# EAGLE design pc_afe4490_brk_v2 (EAGLE 6.4)
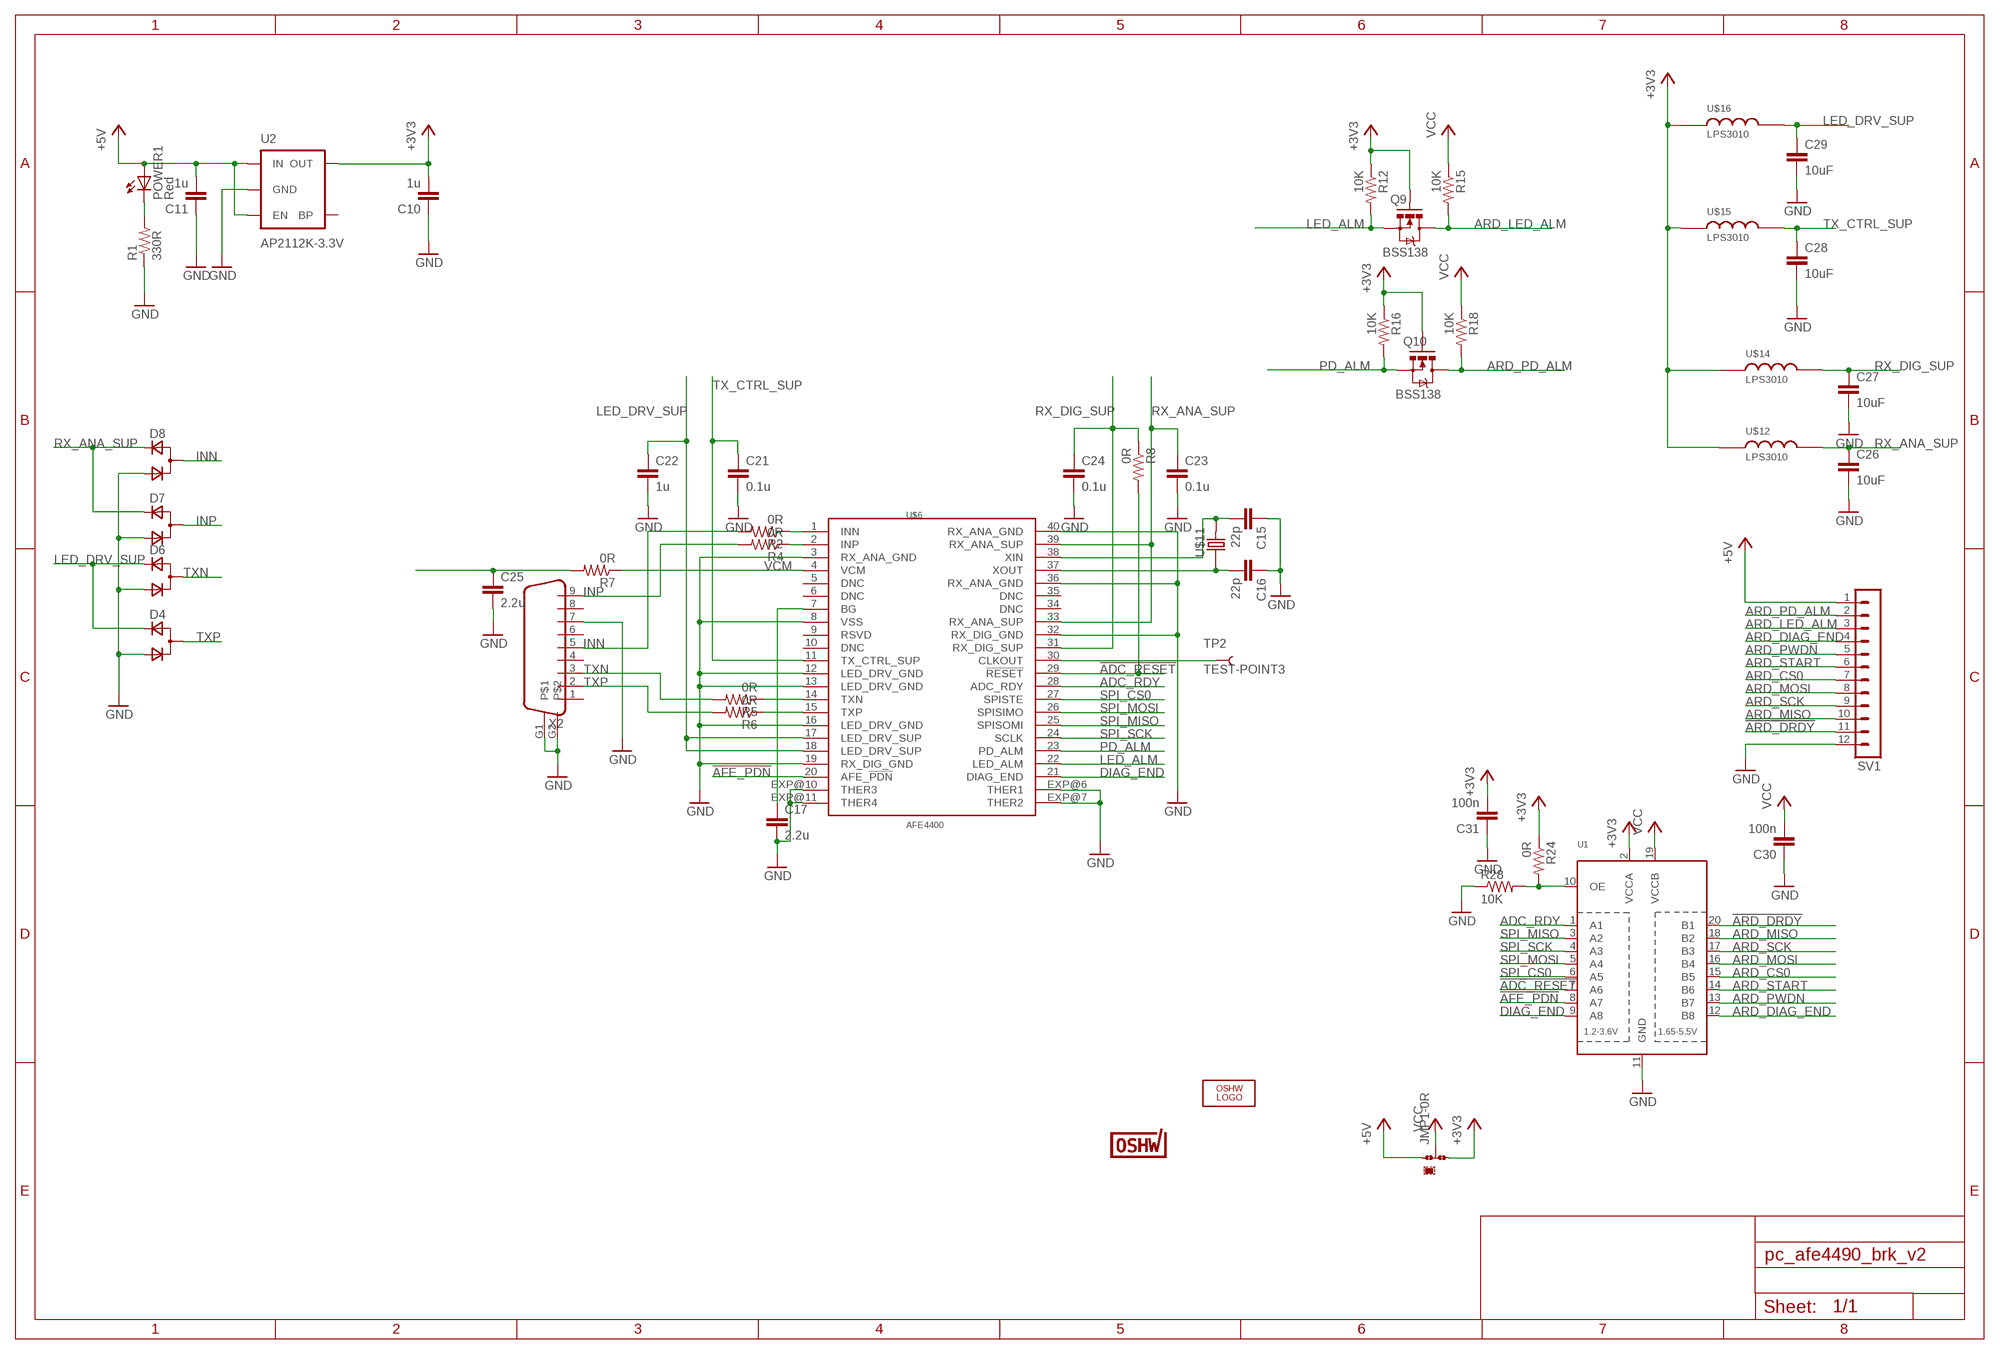
[diagram p0: schematic, sheet 1]

## Parts
C10  1u  C-EUC0805  [C0805]
C11  1u  C-EUC0805  [C0805]
C15  22p  C-EUC0402  [C0402]
C16  22p  C-EUC0402  [C0402]
C17  2.2u  C-EUC0402  [C0402]
C21  0.1u  C-EUC0805  [C0805]
C22  1u  C-EUC0805  [C0805]
C23  0.1u  C-EUC0805  [C0805]
C24  0.1u  C-EUC0805  [C0805]
C25  2.2u  C-EUC0402  [C0402]
C26  10uF  C-EUC0805  [C0805]
C27  10uF  C-EUC0805  [C0805]
C28  10uF  C-EUC0805  [C0805]
C29  10uF  C-EUC0805  [C0805]
C30  100n  C-EUC0402  [C0402]
C31  100n  C-EUC0402  [C0402]
D4  D_ACACSOT323  [SOT323]
D6  D_ACACSOT323  [SOT323]
D7  D_ACACSOT323  [SOT323]
D8  D_ACACSOT323  [SOT323]
JMP1  0R-JUMPA  [A0R-JMP]
LOGO2  OSHW_LOGO_FILLX0200-NT  [OSHW_FILLX200_NOTEXT]
POWER1  Red  LEDCHIPLED_0603  [CHIPLED_0603]
Q9  BSS138  MOSFET-NCHANNELSMD  [SOT23-3]
Q10  BSS138  MOSFET-NCHANNELSMD  [SOT23-3]
R1  330R  R-US_R0805  [R0805]
R2  0R  R-US_R0402  [R0402]
R4  0R  R-US_R0402  [R0402]
R5  0R  R-US_R0805  [R0805]
R6  0R  R-US_R0805  [R0805]
R7  0R  R-US_R0402  [R0402]
R8  0R  R-US_R0805  [R0805]
R12  10K  RESISTOR0805-RES  [0805]
R15  10K  RESISTOR0805-RES  [0805]
R16  10K  RESISTOR0805-RES  [0805]
R18  10K  RESISTOR0805-RES  [0805]
R24  0R  RESISTOR0805-RES  [0805]
R28  10K  RESISTOR0805-RES  [0805]
SV1  MA12-1  [MA12-1]
TP2  TEST-POINT3  [PAD.03X.03]
U1  TXB0108PWR  [TSSOP20]
U2  AP2112K-3.3V  V_REG_LDOSMD  [SOT23-5]
U$1  PROTY-LOGO  [LOGO-PROTY]
U$3  PROTY_LOGO_WITH_TEXT  [PROTY_WITH_TEXT]
U$4  CERT-SMALL  [CERT-SMALL-SILK]
U$6  AFE4400  [QFN-40]
U$11  ABM3  [ABM3]
U$12  LPS3010  LPS  [LPS]
U$14  LPS3010  LPS  [LPS]
U$15  LPS3010  LPS  [LPS]
U$16  LPS3010  LPS  [LPS]
X2  DB9  [DB9]

## Nets
!ADC_RESET: R8.2 U1.7(A6) U$6.29(!RESET)
!AFE_PDN: U1.8(A7) U$6.20(AFE_!PDN)
!ARD_DRDY: SV1.11 U1.20(B1)
+3V3: C10.2 C31.2 JMP1.3 Q9.1(G) Q10.1(G) R12.1 R16.1 R24.1 U1.2(VCCA) U2.5(OUT) U$12.1 U$14.1 U$15.1 U$16.1
+5V: C11.2 JMP1.1 POWER1.A SV1.1 U2.1(IN) U2.3(EN)
ADC_RDY: U1.1(A1) U$6.28(ADC_RDY)
ARD_CS0: SV1.7 U1.15(B5)
ARD_DIAG_END: SV1.4 U1.12(B8)
ARD_LED_ALM: Q9.3(D) R15.2 SV1.3
ARD_MISO: SV1.10 U1.18(B2)
ARD_MOSI: SV1.8 U1.16(B4)
ARD_PD_ALM: Q10.3(D) R18.2 SV1.2
ARD_PWDN: SV1.5 U1.13(B7)
ARD_SCK: SV1.9 U1.17(B3)
ARD_START: SV1.6 U1.14(B6)
DIAG_END: U1.9(A8) U$6.21(DIAG_END)
GND: C10.1 C11.1 C15.1 C16.1 C17.2 C21.2 C22.2 C23.2 C24.2 C25.2 C26.2 C27.2 C28.2 C29.2 C30.1 C31.1 D4.2(C) D6.2(C) D7.2(C) D8.2(C) R1.1 R28.1 SV1.12 U1.11(GND) U2.2(GND) U$6.3(RX_ANA_GND) U$6.8(VSS) U$6.12(LED_DRV_GND) U$6.13(LED_DRV_GND) U$6.16(LED_DRV_GND) U$6.19(RX_DIG_GND) U$6.32(RX_DIG_GND) U$6.36(RX_ANA_GND) U$6.40(RX_ANA_GND) U$6.EXP@6(THER1) U$6.EXP@7(THER2) U$6.EXP@10(THER3) U$6.EXP@11(THER4) X2.7 X2.G1 X2.G2
INN: D8.1(CA) R2.2 X2.5
INP: D7.1(CA) R4.2 X2.9
LED_ALM: Q9.2(S) R12.2 U$6.22(LED_ALM)
LED_DRV_SUP: C22.1 C29.1 D4.3(A) D6.3(A) U$6.17(LED_DRV_SUP) U$6.18(LED_DRV_SUP) U$16.2
N$15: POWER1.C R1.2
N$16: C15.2 U$6.38(XIN) U$11.2
N$19: C16.2 U$6.37(XOUT) U$11.1
N$20: C17.1 U$6.7(BG)
N$22: TP2.P$1 U$6.30(CLKOUT)
N$23: R2.1 U$6.1(INN)
N$24: R4.1 U$6.2(INP)
N$25: R5.1 U$6.14(TXN)
N$26: R6.1 U$6.15(TXP)
N$27: C25.1 R7.2
OE: R24.2 R28.2 U1.10(OE)
PD_ALM: Q10.2(S) R16.2 U$6.23(PD_ALM)
RX_ANA_SUP: C23.1 C26.1 D7.3(A) D8.3(A) U$6.33(RX_ANA_SUP) U$6.39(RX_ANA_SUP) U$12.2
RX_DIG_SUP: C24.1 C27.1 R8.1 U$6.31(RX_DIG_SUP) U$14.2
SPI_CS0: U1.6(A5) U$6.27(SPISTE)
SPI_MISO: U1.3(A2) U$6.25(SPISOMI)
SPI_MOSI: U1.5(A4) U$6.26(SPISIMO)
SPI_SCK: U1.4(A3) U$6.24(SCLK)
TX_CTRL_SUP: C21.1 C28.1 U$6.11(TX_CTRL_SUP) U$15.2
TXN: D6.1(CA) R5.2 X2.3
TXP: D4.1(CA) R6.2 X2.2
VCC: C30.2 JMP1.2 R15.1 R18.1 U1.19(VCCB)
VCM: R7.1 U$6.4(VCM)
Unconnected: U2.4(BP) U$6.5(DNC) U$6.6(DNC) U$6.9(RSVD) U$6.10(DNC) U$6.34(DNC) U$6.35(DNC) X2.1 X2.4 X2.6 X2.8

## Library data of the parts
C10 C11 C15-C17 C21-C31 = rcl:C-EU: CAPACITOR, European symbol
D4 D6-D8 = zetex:D_ACAC: Dual DIODE; OC_FARNELL: unknown; OC_NEWARK: unknown
JMP1 = jump-0r-smd:0R-JUMP: SMD 0R 0805 Jumper
LOGO2 = ohw-logo:OSHW_LOGO_FILL
POWER1 = led:LED: LED OSRAM: - CHIPLED LG R971, LG N971, LY N971, LG Q971, LY Q971, LO R971, LY R971 LH N974, LH R974 LS Q976, LO Q976, LY Q976 LO Q996 - Hyper CHIPLED LW Q18S LB Q993, LB Q99A, LB R99A - SideLED LS A670, LO A670, LY A670, LG A670, LP A670 LB A673, LV A673, LT A673, LW A673 LH A674 LY A675 LS A676, LA A676, LO A676, LY A676, LW A676 LS A679, LY A679, LG A679 - Hyper Micro SIDELED® LS Y876, LA Y876, LO Y876, LY Y876 LT Y87S - SmartLED LW L88C, LW L88S LB L89C, LB L89S, LG L890 LS L89K, LO L89K, LY L89K LS L896, LA L896, LO L896, LY L896 - TOPLED LS T670, LO T670, LY T670, LG T670, LP T670 LSG T670, LSP T670, LSY T670, LOP T670, LYG T670 LG T671, LOG T671, LSG T671 LB T673, LV T673, LT T673, LW T673 LH T674 LS T676, LA T676, LO T676, LY T676, LB T676, LH T676, LSB T676, LW T676 LB T67C, LV T67C, LT T67C, LS T67K, LO T67K, LY T67K, LW E67C LS E67B, LA E67B, LO E67B, LY E67B, LB E67C, LV E67C, LT E67C LW T67C LS T679, LY T679, LG T679 LS T770, LO T770, LY T770, LG T770, LP T770 LB T773, LV T773, LT T773, LW T773 LH T774 LS E675, LA E675, LY E675, LS T675 LS T776, LA T776, LO T776, LY T776, LB T776 LHGB T686 LT T68C, LB T68C - Hyper Mini TOPLED® LB M676 - Mini TOPLED Santana® LG M470 LS M47K, LO M47K, LY M47K Source: http://www.osram.convergy.de LUXEON: - LUMILED® LXK2-PW12-R00, LXK2-PW12-S00, LXK2-PW14-U00, LXK2-PW14-V00 LXK2-PM12-R00, LXK2-PM12-S00, LXK2-PM14-U00 LXK2-PE12-Q00, LXK2-PE12-R00, LXK2-PE12-S00, LXK2-PE14-T00, LXK2-PE14-U00 LXK2-PB12-K00, LXK2-PB12-L00, LXK2-PB12-M00, LXK2-PB14-N00, LXK2-PB14-P00, LXK2-PB14-Q00 LXK2-PR12-L00, LXK2-PR12-M00, LXK2-PR14-Q00, LXK2-PR14-R00 LXK2-PD12-Q00, LXK2-PD12-R00, LXK2-PD12-S00 LXK2-PH12-R00, LXK2-PH12-S00 LXK2-PL12-P00, LXK2-PL12-Q00, LXK2-PL12-R00 Source: www.luxeon.com KINGBRIGHT: KA-3528ASYC Source: www.kingbright.com
Q9 Q10 = SparkFun:MOSFET-NCHANNEL
R1 R2 R4-R8 = rcl:R-US_: RESISTOR, American symbol
R12 R15 R16 R18 R24 R28 = SparkFun:RESISTOR: Resistor Basic schematic elements and footprints for 0603, 1206, and PTH resistors.
SV1 = con-lstb:MA12-1: PIN HEADER; OC_FARNELL: unknown; OC_NEWARK: unknown
TP2 = SparkFun:TEST-POINT
U1 = adafruit:TXB0108PWR: 8-Bit Bi-Directional Level Shifter 1.2V-3.6V (VCCA) to 1.65V-5.5V (VCCB) bi-directional level shifter with auto direction sensing. Max data rate - VCCA 1.8V: 20Mbps (50ns), VCCA 3.3V: 100Mbps (10ns) Digikey: 296-21527-1-ND
U2 = SparkFun-PowerIC:V_REG_LDO: Voltage Regulator LDO Standard 150mA LDO voltage regulator in SOT-23 layout. Micrel part MIC5205. BP (by-pass) pin is used to lower output noise with 470pF cap.; PROD_ID: VREG-12457
U$1 = circuitects:PROTY-LOGO
U$3 = circuitects:PROTY_LOGO_WITH_TEXT
U$4 = OSHWA:CERT
U$6 = circuitects:AFE4400
U$11 = circuitects:ABM3
U$12 U$14-U$16 = circuitects:LPS
X2 = circuitects:DB9: DB9 Connector Standard DB9 (D-Sub 9) serial connector. Can be used for CAN bus as well as RS485 and RS232. Footprint production proven. Spark Fun Electronics SKU : PRT-00429

## Board
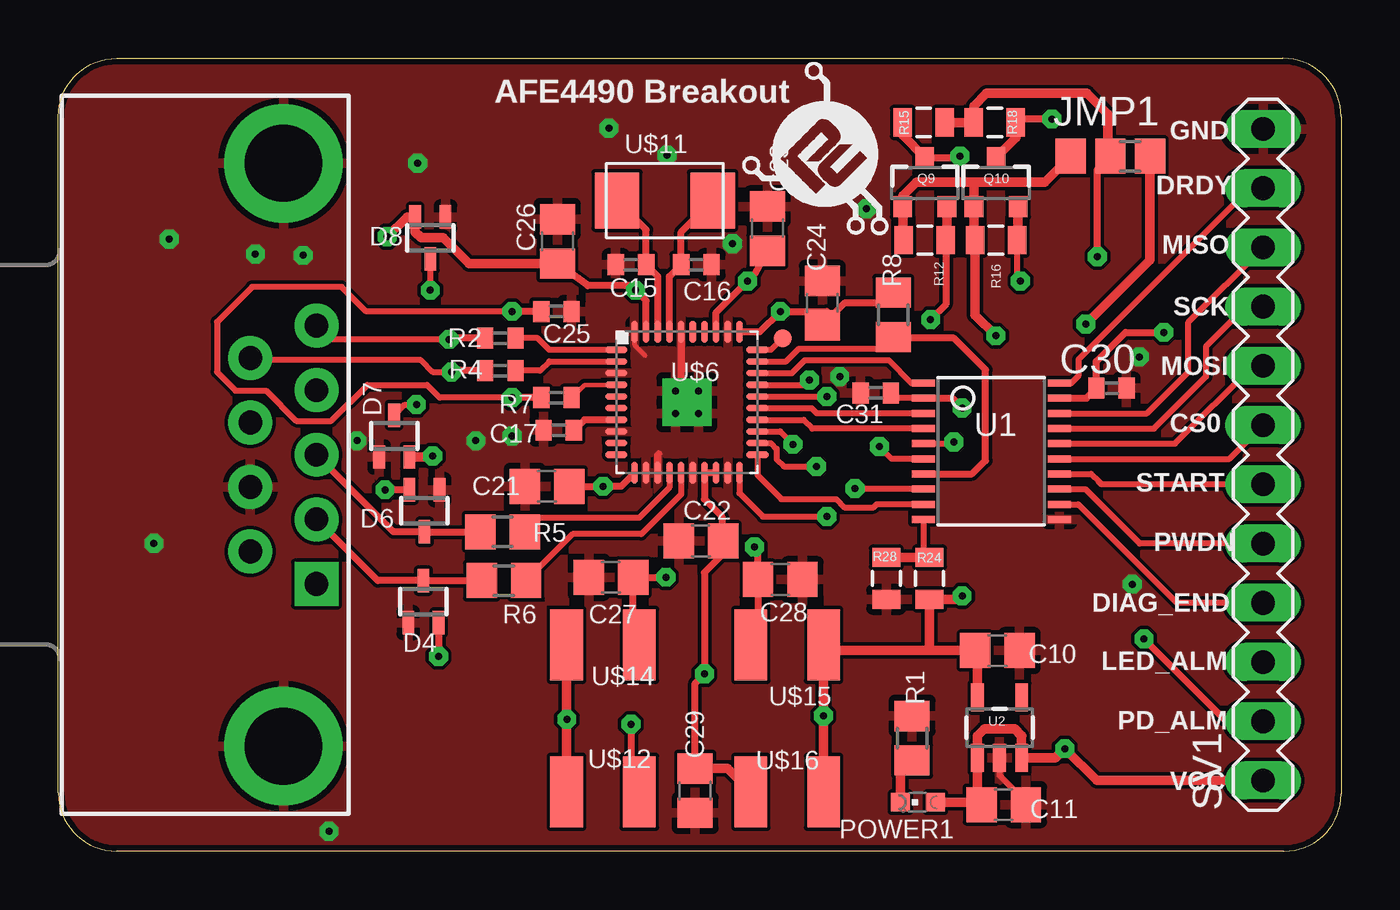
[diagram p1: board, top side]
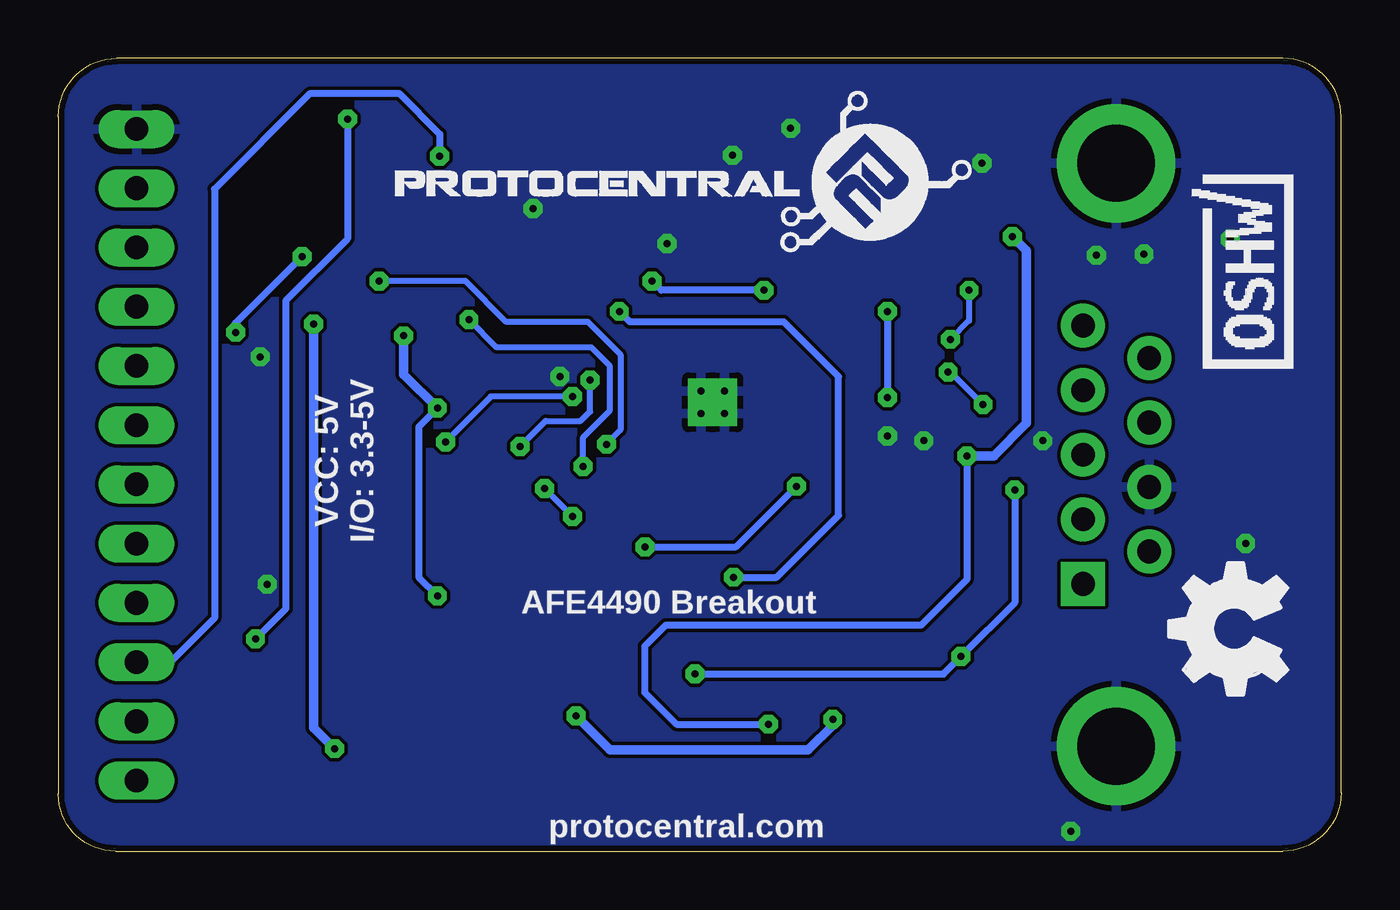
[diagram p2: board, bottom side, seen from below]

Size 55 x 34 mm. Coordinates in mm from the lower left corner, seen from the top.
Outline: 2.5,34 52.5,34 arc-90 55,31.5 55,2.45 arc-90 52.55,0 2.5,0 arc-90 0,2.5 0,31.5 arc-90 2.5,34
Copper layers (1*2*15*16): Top 0.035mm / dielectric 1.5mm / Route2 0.035mm / dielectric 0.15mm / Route15 0.035mm / dielectric 0.2mm / Bottom 0.035mm
Design rules "Circuitects-Rules": minimum track width 6mil, minimum drill 0.3mm, track to track 6mil, track to pad 6mil, pad to pad 6mil, via to via 6mil, smd to smd 6mil, copper to edge 10mil, drill to drill 8mil, minimum pad ring 12mil, minimum via ring 10mil, stop-mask expansion 4mil, vias tented up to drill 25mil, thermal gap 10mil

### Footprints (pad centres in the part's own frame; a part is rotated, then mirrored left to right if it is on the bottom)
C0805 = smd 1.3 x 1.5: 1 -0.95,0; 2 0.95,0
C0402 = smd 0.7 x 0.9: 1 -0.65,0; 2 0.65,0
SOT323 = smd 0.5 x 1: 1 0,0.9; 2 -0.65,-0.9; 3 0.65,-0.9
A0R-JMP = smd 1.5 x 1.3: 1 0,1.7; 2 0,0; 3 0,-1.7
CHIPLED_0603 = smd 0.8 x 0.8: A 0,-0.75; C 0,0.75
SOT23-3 = smd 0.8 x 0.9: 1 -0.95,-1; 2 0.95,-1; 3 0,1.1
R0805 = smd 1.3 x 1.5: 1 -0.95,0; 2 0.95,0
R0402 = smd 0.7 x 0.9: 1 -0.65,0; 2 0.65,0
0805 = smd 0.8 x 1.2: 1 -0.9,0; 2 0.9,0
MA12-1 = drill 1.016 long: 1 -13.97,0; 2 -11.43,0; 3 -8.89,0; 4 -6.35,0; 5 -3.81,0; 6 -1.27,0; 7 1.27,0; 8 3.81,0; 9 6.35,0; 10 8.89,0; 11 11.43,0; 12 13.97,0
PAD.03X.03 = smd 0.762 x 0.762: P$1 0,0
TSSOP20 = smd 0.305 x 0.991: 1 -2.925,-2.918; 2 -2.275,-2.918; 3 -1.625,-2.918; 4 -0.975,-2.918; 5 -0.325,-2.918; 6 0.325,-2.918; 7 0.975,-2.918; 8 1.625,-2.918; 9 2.275,-2.918; 10 2.925,-2.918; 11 2.925,2.918; 12 2.275,2.918; 13 1.625,2.918; 14 0.975,2.918; 15 0.325,2.918; 16 -0.325,2.918; 17 -0.975,2.918; 18 -1.625,2.918; 19 -2.275,2.918; 20 -2.925,2.918
SOT23-5 = smd 0.55 x 1.2: 1 -0.95,-1.3; 2 0,-1.3; 3 0.95,-1.3; 4 0.95,1.3; 5 -0.95,1.3
QFN-40 = smd 0.95 x 0.28: 1 -3.025,2.25; 2 -3.025,1.75; 3 -3.025,1.25; 4 -3.025,0.75; 5 -3.025,0.25; 6 -3.025,-0.25; 7 -3.025,-0.75; 8 -3.025,-1.25; 9 -3.025,-1.75; 10 -3.025,-2.25; 21 3.025,-2.25; 22 3.025,-1.75; 23 3.025,-1.25; 24 3.025,-0.75; 25 3.025,-0.25; 26 3.025,0.25; 27 3.025,0.75; 28 3.025,1.25; 29 3.025,1.75; 30 3.025,2.25 | smd 0.28 x 0.95: 11 -2.25,-3.025; 12 -1.75,-3.025; 13 -1.25,-3.025; 14 -0.75,-3.025; 15 -0.25,-3.025; 16 0.25,-3.025; 17 0.75,-3.025; 18 1.25,-3.025; 19 1.75,-3.025; 20 2.25,-3.025; 31 2.25,3.025; 32 1.75,3.025; 33 1.25,3.025; 34 0.75,3.025; 35 0.25,3.025; 36 -0.25,3.025; 37 -0.75,3.025; 38 -1.25,3.025; 39 -1.75,3.025; 40 -2.25,3.025 | drill 0.3 pad 1.1 square: EXP@6 -0.5,0.475; EXP@7 0.5,0.475; EXP@10 -0.5,-0.475; EXP@11 0.5,-0.475
ABM3 = smd 1.9 x 2.4: 1 -2.05,0; 2 2.05,0
LPS = smd 1.4 x 3.05: 1 -1.56,0; 2 1.56,0
DB9 = drill 1.016 pad 1.88 square: 1 -5.54,-1.42 | drill 1.016 pad 1.88: 2 -2.77,-1.42; 3 0,-1.42; 4 2.77,-1.42; 5 5.54,-1.42; 6 -4.15,1.42; 7 -1.38,1.42; 8 1.38,1.42; 9 4.15,1.42 | drill 3.302 pad 5.08: G1 -12.5,0; G2 12.5,0

### Placement (x,y rotation side)
C10  40.26,8.6 180 top
C11  40.53,2 180 top
C15  24.55,25.15 0 top
C16  27.35,25.15 180 top
C17  21.45,18.05 180 top
C21  20.95,15.65 180 top
C22  27.55,13.3 180 top
C23  30.4,26.7 90 top
C24  32.75,23.5 90 top
C25  21.35,23.15 0 top
C26  21.4,26.15 90 top
C27  23.7,11.75 180 top
C28  30.95,11.65 0 top
C29  27.3,2.6 270 top
C30  45.15,19.85 180 top
C31  35.05,19.65 0 top
D4  15.65,10.7 0 top
D6  15.7,14.6 180 top
D7  14.4,17.8 0 top
D8  15.95,26.3 180 top
JMP1  45.1,29.8 270 top
LOGO2  2.3,6.7 90 bottom
POWER1  36.85,2.1 90 top
Q9  37.15,28.65 0 top
Q10  40.2,28.65 0 top
R1  36.6,4.85 270 top
R2  18.95,22 180 top
R4  18.95,20.6 180 top
R5  19.05,13.7 180 top
R6  19.1,11.6 180 top
R7  21.35,19.45 180 top
R8  35.8,23 270 top
R12  37.15,26.2 0 top
R15  37.1,31.25 180 top
R16  40.2,26.2 0 top
R18  40.15,31.25 0 top
R24  37.35,11.7 90 top
R28  35.5,11.7 90 top
SV1  51.65,17 90 top
TP2  31.05,22 0 top
U1  40,17.15 270 top
U2  40.35,5.3 0 top
U$1  35.7,26.35 90 top
U$3  40.55,26.05 0 bottom
U$4  2.05,24.85 90 bottom
U$6  26.95,19.25 0 top
U$11  26,27.9 180 top
U$12  23.35,2.55 0 top
U$14  23.35,8.85 0 top
U$15  31.25,8.85 180 top
U$16  31.25,2.55 180 top
X2  9.65,17 90 top

### Tracks (layer width: path | path; a pad name or v marks a point on that pad's centre or on a via)
!ADC_RESET
  Top 0.254: U$6.29 31.2,21 31.75,21.55 35.3,21.55 R8.2
  Top 0.305: U1.7 39.17,16.18 39.75,16.75 39.75,20.65 38.4,22 35.85,22 R8.2
!AFE_PDN  (via drill 0.3)
  Top 0.254: U1.8 34.17,15.53 v34.15,15.55 | U$6.20 29.2,15.35 30.2,14.35 v32.95,14.35
  Bottom 0.254: v32.95,14.35 v34.15,15.55
!ARD_DRDY
  Top 0.254: U1.20 43.42,20.07 43.75,20.4 43.75,21.1 51.08,28.43 SV1.11
+3V3  (via drill 0.3)
  Top 0.254: U1.2 35.92,19.43 C31.2
  Top 0.305: U1.2 38.33,19.43 v38.75,19 | 33.06,8.6 33.06,8.35 32.81,8.1
  Top 0.406: 32.81,8.1 v32.81,5.81 v32.8,5.8 v32.81,5.79 U$16.1 | U$14.1 v21.79,5.66 v21.8,5.65 v21.79,5.64 U$12.1 | 37.25,8.6 C10.2 39.4,8.51 U2.5 | 37.25,8.6 33.06,8.6 U$15.1 | 37.25,8.6 37.35,8.7 R24.1 38.6,10.8 v38.75,10.95 | R12.1 36.2,26.25 Q9.1 36.2,28.1 36.8,28.7 39.15,28.7 | v40.2,22.1 39.3,23 R16.1 39.25,26.25 Q10.1 39.25,28.6 39.15,28.7 | 39.15,28.7 42.3,28.7 JMP1.3
  Bottom 0.305: v38.75,19 39.55,18.2 39.55,11.75 v38.75,10.95
  Bottom 0.406: v21.8,5.65 21.8,5.4 22.85,4.35 31.35,4.35 v32.8,5.8 | v40.2,22.1 40.2,20.45 v38.75,19
+5V  (via drill 0.3)
  Top 0.406: 39.84,2.19 C11.2 | POWER1.A 39.48,2.1 C11.2 | JMP1.1 46.8,25.35 v44.05,22.6 | C11.2 39.4,2.18 U2.1 39.4,4.95 39.7,5.25 41,5.25 41.3,4.95 U2.3 42.75,4 v43.15,4.4 44.52,3.03 SV1.1
  Bottom 0.406: v44.05,22.6 44.05,5.3 v43.15,4.4
ADC_RDY
  Top 0.254: U$6.28 31.45,20.5 32,21.05 35.6,21.05 36.58,20.07 U1.1
ARD_CS0
  Top 0.254: U1.15 50.2,16.82 SV1.7
ARD_DIAG_END
  Top 0.254: U1.12 43.73,14.88 47.95,10.65 SV1.4
ARD_LED_ALM  (via drill 0.3)
  Top 0.305: Q9.3 38.6,29.75 v38.65,29.8
  Top 0.406: R15.2 36.2,30.7 Q9.3
  Bottom 0.305: SV1.3 50.19,8.11 48.3,10 48.3,28.4 44.2,32.5 40.4,32.5 38.65,30.75 v38.65,29.8
ARD_MISO
  Top 0.254: U1.18 46.67,18.77 48.45,20.55 48.45,22.69 SV1.10
ARD_MOSI
  Top 0.254: U1.16 47.88,17.48 51.21,20.81 SV1.8
ARD_PD_ALM  (via drill 0.3)
  Top 0.305: SV1.2 50.08,5.57 v46.55,9.1 | v42.6,31.4 41.2,31.4 R18.2
  Top 0.406: R18.2 41.05,30.6 Q10.3
  Bottom 0.305: v46.55,9.1 45.25,10.4 45.25,23.6 42.6,26.25 v42.6,31.4
ARD_PWDN
  Top 0.254: U1.13 44.02,15.53 46.36,13.19 SV1.5
ARD_SCK
  Top 0.254: U1.17 46.98,18.12 49.2,20.35 49.2,21.65 50.9,23.35 SV1.9
ARD_START
  Top 0.254: U1.14 44.27,16.18 44.6,15.85 44.7,15.75 44.72,15.73 SV1.6
DIAG_END
  Top 0.254: U$6.21 29.98,16.12 31,15.1 33.35,15.1 33.7,14.75 34.95,14.75 35.08,14.88 U1.9
GND  (via drill 0.3)
  Top 0.2: U$6.40 24.7,21.7 25.15,21.25
  Top 0.254: C11.1 41.48,2.12 40.35,3.25 U2.2
  Top 0.305: U$6.36 26.7,19.98 U$6.EXP@6 | U$6.13 25.7,17 25.75,17.05
  Bottom 0.305: U$6.EXP@10 U$6.EXP@11 U$6.EXP@7 U$6.EXP@6
  other vias: 11.6,0.85 17.9,17.6 26.1,29.85 4.75,26.25 23.6,31 15.4,29.5 10.5,25.55 19.45,17.8 4.1,13.2 8.45,25.6 28.9,26.05 33.5,20.35 46.35,21.2 46.05,11.45 34.65,27.55 12.8,17.6
  pour Top: 0,33.55 55.85,33.7 55.95,0 0.15,0
  pour Bottom: 0,33.65 55.95,33.7 56.05,-0.2 0.35,0.15
INN  (via drill 0.3)
  Top 0.254: D8.1 v15.95,24.05 | v16.75,21.95 11.66,21.95 X2.5
  Top 0.305: R2.2 16.8,22 v16.75,21.95 16.71,21.99
  Bottom 0.254: v15.95,24.05 15.95,22.75 v16.75,21.95
INP  (via drill 0.3)
  Top 0.254: v16.85,20.55 16.05,20.55 15.55,21.05 8.33,21.05 X2.9 | D7.1 14.85,19.15 v15.35,19.15
  Top 0.305: R4.2 16.9,20.6 v16.85,20.55 16.8,20.61
  Bottom 0.254: v15.35,19.15 16.75,20.55 v16.85,20.55
LED_ALM  (via drill 0.3)
  Top 0.254: U$6.22 30.55,17.5 30.8,17.25 30.8,16.8 31.1,16.5 v32.5,16.5
  Top 0.305: v37.4,22.8 38.05,23.45 R12.2
  Top 0.406: Q9.2 38.1,26.25 R12.2
  Bottom 0.254: v32.5,16.5 32.5,17.75 31.35,18.9 31.35,20.8 32.15,21.6 36.2,21.6 v37.4,22.8
LED_DRV_SUP  (via drill 0.3)
  Top 0.305: U$6.18 U$6.17 27.7,15.1 28.45,14.35 28.45,13.35 C22.1 28.5,12.75 27.7,11.95 v27.7,7.6 27.3,7.2 C29.1 | D6.3 v14,15.5 | D4.3 v16.3,8.35
  Top 0.406: 29.73,2.8 U$16.2 28.69,3.55 C29.1
  Bottom 0.305: v14,15.5 14,10.65 v16.3,8.35 17.05,7.6 v27.7,7.6
N$15
  Top 0.406: POWER1.C 36.1,3.4 R1.2
N$16
  Top 0.305: U$6.38 25.7,24.65 C15.2 25.2,26.65 U$11.2
N$19
  Top 0.305: U$6.37 26.2,24.65 C16.2 26.7,26.55 U$11.1
N$20
  Top 0.305: U$6.7 22.55,18.5 C17.1
N$22
  Top 0.254: TP2.P$1 30.55,21.5 U$6.30
N$23
  Top 0.254: U$6.1 21.05,21.5 20.55,22 R2.1
N$24
  Top 0.254: U$6.2 21.05,21 20.65,20.6 R4.1
N$25
  Top 0.254: U$6.14 26.2,15.6 24.9,14.3 20.6,14.3 R5.1
N$26
  Top 0.254: U$6.15 26.7,15.3 25,13.6 22.05,13.6 R6.1
N$27  (via drill 0.3)
  Top 0.254: v19.45,23.15 13.2,23.15 12.15,24.2 8.3,24.2 6.8,22.7 6.8,20.55 7.6,19.75 8.9,19.75 10.2,18.45 11.7,18.45 13.25,20 15.8,20 16.35,19.45 v19.45,19.45
  Top 0.305: R7.2 v19.45,19.45 | C25.1 v19.45,23.15
  Bottom 0.305: v19.45,23.15 v19.45,19.45
OE
  Top 0.254: U1.10 37.08,12.87 R24.2
  Top 0.406: R24.2 R28.2
PD_ALM  (via drill 0.3)
  Top 0.254: U$6.23 30.95,18 v31.5,17.45 | R16.2 41.1,24.6 v41.25,24.45
  Top 0.406: Q10.2 41.15,26.25 R16.2
  Bottom 0.254: v31.5,17.45 30.9,18.05 30.9,21.3 32.3,22.7 35.8,22.7 37.55,24.45 v41.25,24.45
RX_ANA_SUP  (via drill 0.3)
  Top 0.305: U$6.39 25.2,23.6 v24.75,24.05 24.55,24.25 22.7,24.25 C26.1 | U$6.33 28.2,23.1 v29.55,24.45 29.85,24.75 C23.1 | v24.55,5.45 24.55,2.62 U$12.2
  Top 0.406: D7.3 16,16.9 v16.05,16.95 | v14.1,26.35 14.95,27.2 D8.3 15.3,26.55 15.55,26.3 16.5,26.3 17.6,25.2 C26.1
  Bottom 0.305: v24.55,5.45 28.5,5.45 29.85,6.8 29.85,8.8 28.95,9.7 18,9.7 16.75,10.95 16.6,11.1 16.05,11.65 v16.05,16.95 | v24.75,24.05 29.15,24.05 v29.55,24.45
  Bottom 0.406: v16.05,16.95 14.9,16.95 13.5,18.35 13.5,25.75 v14.1,26.35
RX_DIG_SUP  (via drill 0.3)
  Top 0.305: U$14.2 24.6,8.87 C27.1 v26.05,11.75 | U$6.31 30.07,22.27 v30.95,23.15 32.95,23.15 33.15,22.95 | R8.1 35.6,23.95 35.15,23.5 33.7,23.5 33.15,22.95 | 33.15,22.95 C24.1
  Bottom 0.305: v26.05,11.75 24.2,11.75 21.55,14.4 21.55,20.35 23.9,22.7 30.5,22.7 v30.95,23.15
SPI_CS0  (via drill 0.3)
  Top 0.254: U$6.27 32,20 v32.2,20.2 | U1.6 35.73,16.82 v35.2,17.35
  Bottom 0.254: v35.2,17.35 34.1,18.45 32.6,18.45 32.2,18.85 v32.2,20.2
SPI_MISO
  Top 0.254: U$6.25 32.3,19 32.52,18.77 U1.3
SPI_MOSI  (via drill 0.3)
  Top 0.254: U$6.26 v32.95,19.5 | U1.5 38.33,17.48 v38.4,17.55
  Bottom 0.254: v32.95,19.5 36.45,19.5 v38.4,17.55
SPI_SCK
  Top 0.254: U$6.24 31.95,18.5 32.33,18.12 U1.4
TX_CTRL_SUP  (via drill 0.3)
  Top 0.305: U$15.2 30,8.87 C28.1 30,12.9 v29.85,13.05 | U$6.11 24.12,15.65 v23.35,15.65 C21.1
  Bottom 0.305: v29.85,13.05 25.95,13.05 v23.35,15.65
TXN
  Top 0.305: X2.3 14.37,13.7 D6.1 R5.2
TXP
  Top 0.305: X2.2 13.7,11.6 D4.1 R6.2
VCC  (via drill 0.3)
  Top 0.305: U1.19 44.08,19.43 C30.2 44.5,21 45.75,22.25 v47.4,22.25 | v44.55,25.5 44.55,29.25 JMP1.2
  Top 0.406: R15.1 R18.1 39.25,31.95 39.8,32.5 44.1,32.5 45,31.6 45,29.9 JMP1.2
  Bottom 0.305: v47.4,22.25 47.4,22.65 v44.55,25.5
VCM
  Top 0.2: U$6.4 22.55,20 R7.1

### Text on the board
tPlace: AFE4490 Breakout | GND | DRDY | MISO | SCK | MOSI | CS0 | START | PWDN | DIAG_END | LED_ALM | PD_ALM | VCC
bPlace: VCC: 5V / I/O: 3.3-5V | AFE4490 Breakout | protocentral.com